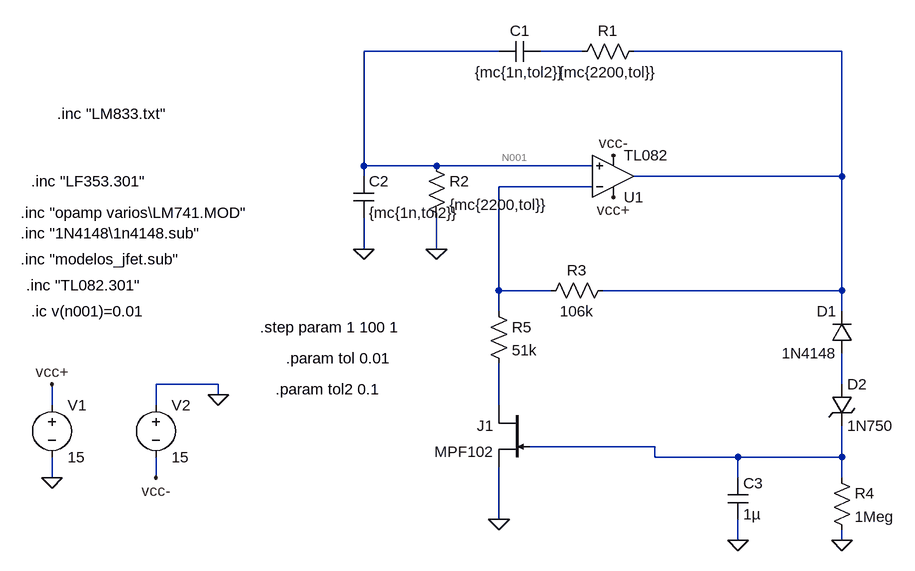
[diagram p0: schematic wien_montecarlo.asc]
wien_montecarlo.asc, the LTspice schematic file:
Version 4
SHEET 1 880 680
WIRE 192 -176 -16 -176
WIRE 320 -176 256 -176
WIRE 720 -176 400 -176
WIRE -16 0 -16 -176
WIRE 96 0 -16 0
WIRE 336 0 96 0
WIRE -16 16 -16 0
WIRE 720 16 720 -176
WIRE 720 16 400 16
WIRE 336 32 192 32
WIRE -16 128 -16 80
WIRE 96 128 96 80
WIRE 192 192 192 32
WIRE 272 192 192 192
WIRE 720 192 720 16
WIRE 720 192 352 192
WIRE 192 224 192 192
WIRE 720 224 720 192
WIRE -240 336 -336 336
WIRE 720 336 720 288
WIRE -240 352 -240 336
WIRE -496 368 -496 336
WIRE -336 368 -336 336
WIRE 192 368 192 304
WIRE 432 432 240 432
WIRE 432 448 432 432
WIRE 560 448 432 448
WIRE 720 448 720 400
WIRE 720 448 560 448
WIRE -496 480 -496 448
WIRE -336 480 -336 448
WIRE 560 480 560 448
WIRE 720 480 720 448
WIRE 192 544 192 464
WIRE 560 576 560 544
WIRE 720 576 720 560
FLAG 560 576 0
FLAG 720 576 0
FLAG -496 480 0
FLAG -240 352 0
FLAG -496 336 vcc+
FLAG -336 480 vcc-
FLAG 192 544 0
FLAG -16 128 0
FLAG 96 128 0
FLAG 368 48 vcc+
FLAG 368 -16 vcc-
SYMBOL res 416 -192 R90
WINDOW 0 0 56 VBottom 2
WINDOW 3 32 56 VTop 2
SYMATTR InstName R1
SYMATTR Value {mc{2200,tol}}
SYMBOL cap 256 -192 R90
WINDOW 0 0 32 VBottom 2
WINDOW 3 32 32 VTop 2
SYMATTR InstName C1
SYMATTR Value {mc{1n,tol2}}
SYMATTR SpiceLine V=0
SYMBOL cap -32 16 R0
SYMATTR InstName C2
SYMATTR Value {mc{1n,tol2}}
SYMBOL res 80 -16 R0
SYMATTR InstName R2
SYMATTR Value {mc{2200,tol}}
SYMBOL res 368 176 R90
WINDOW 0 0 56 VBottom 2
WINDOW 3 32 56 VTop 2
SYMATTR InstName R3
SYMATTR Value 106k
SYMBOL diode 736 288 R180
WINDOW 0 24 64 Left 2
WINDOW 3 24 0 Left 2
SYMATTR InstName D1
SYMATTR Value 1N4148
SYMBOL zener 704 336 R0
SYMATTR InstName D2
SYMATTR Value 1N750
SYMBOL res 704 464 R0
SYMATTR InstName R4
SYMATTR Value 1Meg
SYMBOL cap 544 480 R0
SYMATTR InstName C3
SYMATTR Value 1µ
SYMBOL voltage -496 352 R0
WINDOW 123 0 0 Left 2
WINDOW 39 0 0 Left 2
SYMATTR InstName V1
SYMATTR Value 15
SYMBOL voltage -336 352 R0
WINDOW 123 0 0 Left 2
WINDOW 39 0 0 Left 2
SYMATTR InstName V2
SYMATTR Value 15
SYMBOL res 176 208 R0
SYMATTR InstName R5
SYMATTR Value 51k
SYMBOL njf 240 368 M0
SYMATTR InstName J1
SYMATTR Value MPF102
SYMBOL Opamps\\opamp2 368 80 M180
SYMATTR InstName U1
SYMATTR Value TL082
TEXT -544 72 Left 2 !.inc "opamp varios\\LM741.MOD"
TEXT -544 104 Left 2 !.inc "1N4148\\1n4148.sub"
TEXT -544 144 Left 2 !.inc "modelos_jfet.sub"
TEXT -536 184 Left 2 !.inc "TL082.301"
TEXT -528 224 Left 2 !.ic v(n001)=0.01
TEXT -528 24 Left 2 !.inc "LF353.301"
TEXT -488 -80 Left 2 !.inc "LM833.txt"
TEXT -176 248 Left 2 !.step param 1 100 1
TEXT -136 296 Left 2 !.param tol 0.01
TEXT -152 344 Left 2 !.param tol2 0.1

The netlist it stands for:
* wien_montecarlo.asc
R1 N003 N002 {mc{2200,tol}}
C1 N002 N001 {mc{1n,tol2}} V=0
C2 N001 0 {mc{1n,tol2}}
R2 N001 0 {mc{2200,tol}}
R3 N003 N004 106k
D1 N005 N003 1N4148
D2 N005 N007 1N750
R4 N007 0 1Meg
C3 N007 0 1µ
V1 vcc+ 0 15
V2 0 vcc- 15
R5 N004 N006 51k
J1 N006 N007 0 MPF102
XU1 N001 N004 vcc+ vcc- N003 TL082  ; pins In+ In- V+ V- OUT
.model D D
.lib standard.dio
.model NJF NJF
.model PJF PJF
.lib standard.jft
.inc "opamp varios\LM741.MOD"
.inc "1N4148\1n4148.sub"
.inc "modelos_jfet.sub"
.inc "TL082.301"
.ic v(n001)=0.01
.inc "LF353.301"
.inc "LM833.txt"
.step param 1 100 1
.param tol 0.01
.param tol2 0.1
.backanno
.end